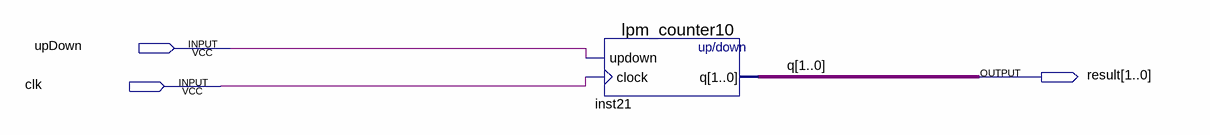
[diagram p0: schematic sheet]
// Quartus schematic Test.bdf as structural Verilog: 1 symbols, 3 pins
module Test (
  input  upDown,
  input  clk,
  output [1:0] result
);

  lpm_counter10 inst21 (.updown(upDown), .clock(clk), .q(result));

  // Other names for the same wires on the sheet: q[1:0] = result
endmodule
